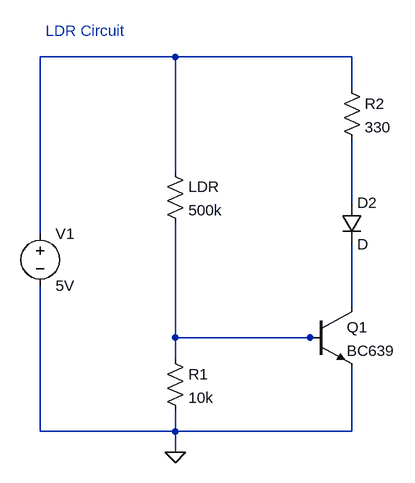
[diagram p0: schematic ECSE_DESIGN_LTSPICE.asc]
ECSE_DESIGN_LTSPICE.asc, the LTspice schematic file:
Version 4.1
SHEET 1 1256 1344
WIRE 48 704 -160 704
WIRE 320 704 48 704
WIRE 320 752 320 704
WIRE 48 880 48 704
WIRE 320 928 320 832
WIRE -160 976 -160 704
WIRE 320 1088 320 992
WIRE 48 1136 48 960
WIRE 256 1136 48 1136
WIRE 272 1136 256 1136
WIRE 48 1168 48 1136
WIRE -160 1280 -160 1056
WIRE 48 1280 48 1248
WIRE 48 1280 -160 1280
WIRE 320 1280 320 1184
WIRE 320 1280 48 1280
WIRE 48 1312 48 1280
FLAG 48 1312 0
SYMBOL res 32 1152 R0
SYMATTR InstName R1
SYMATTR Value 10k
SYMBOL res 304 736 R0
SYMATTR InstName R2
SYMATTR Value 330
SYMBOL diode 304 928 R0
SYMATTR InstName D2
SYMBOL npn 256 1088 R0
SYMATTR InstName Q1
SYMATTR Value BC639
SYMBOL voltage -160 960 R0
WINDOW 123 0 0 Left 0
WINDOW 39 0 0 Left 0
SYMATTR InstName V1
SYMATTR Value 5V
SYMBOL res 32 864 R0
SYMATTR InstName LDR
SYMATTR Value 500k
TEXT -152 664 Left 2 ;LDR Circuit

The netlist it stands for:
* ECSE_DESIGN_LTSPICE.asc
R1 N004 0 10k
R2 N001 N002 330
D2 N002 N003 D
Q1 N003 N004 0 0 BC639
V1 N001 0 5V
R§LDR N001 N004 500k
.model D D
.lib standard.dio
.model NPN NPN
.model PNP PNP
.lib standard.bjt
* LDR Circuit
.backanno
.end